# EAGLE design myRelay (EAGLE 7.6.0)
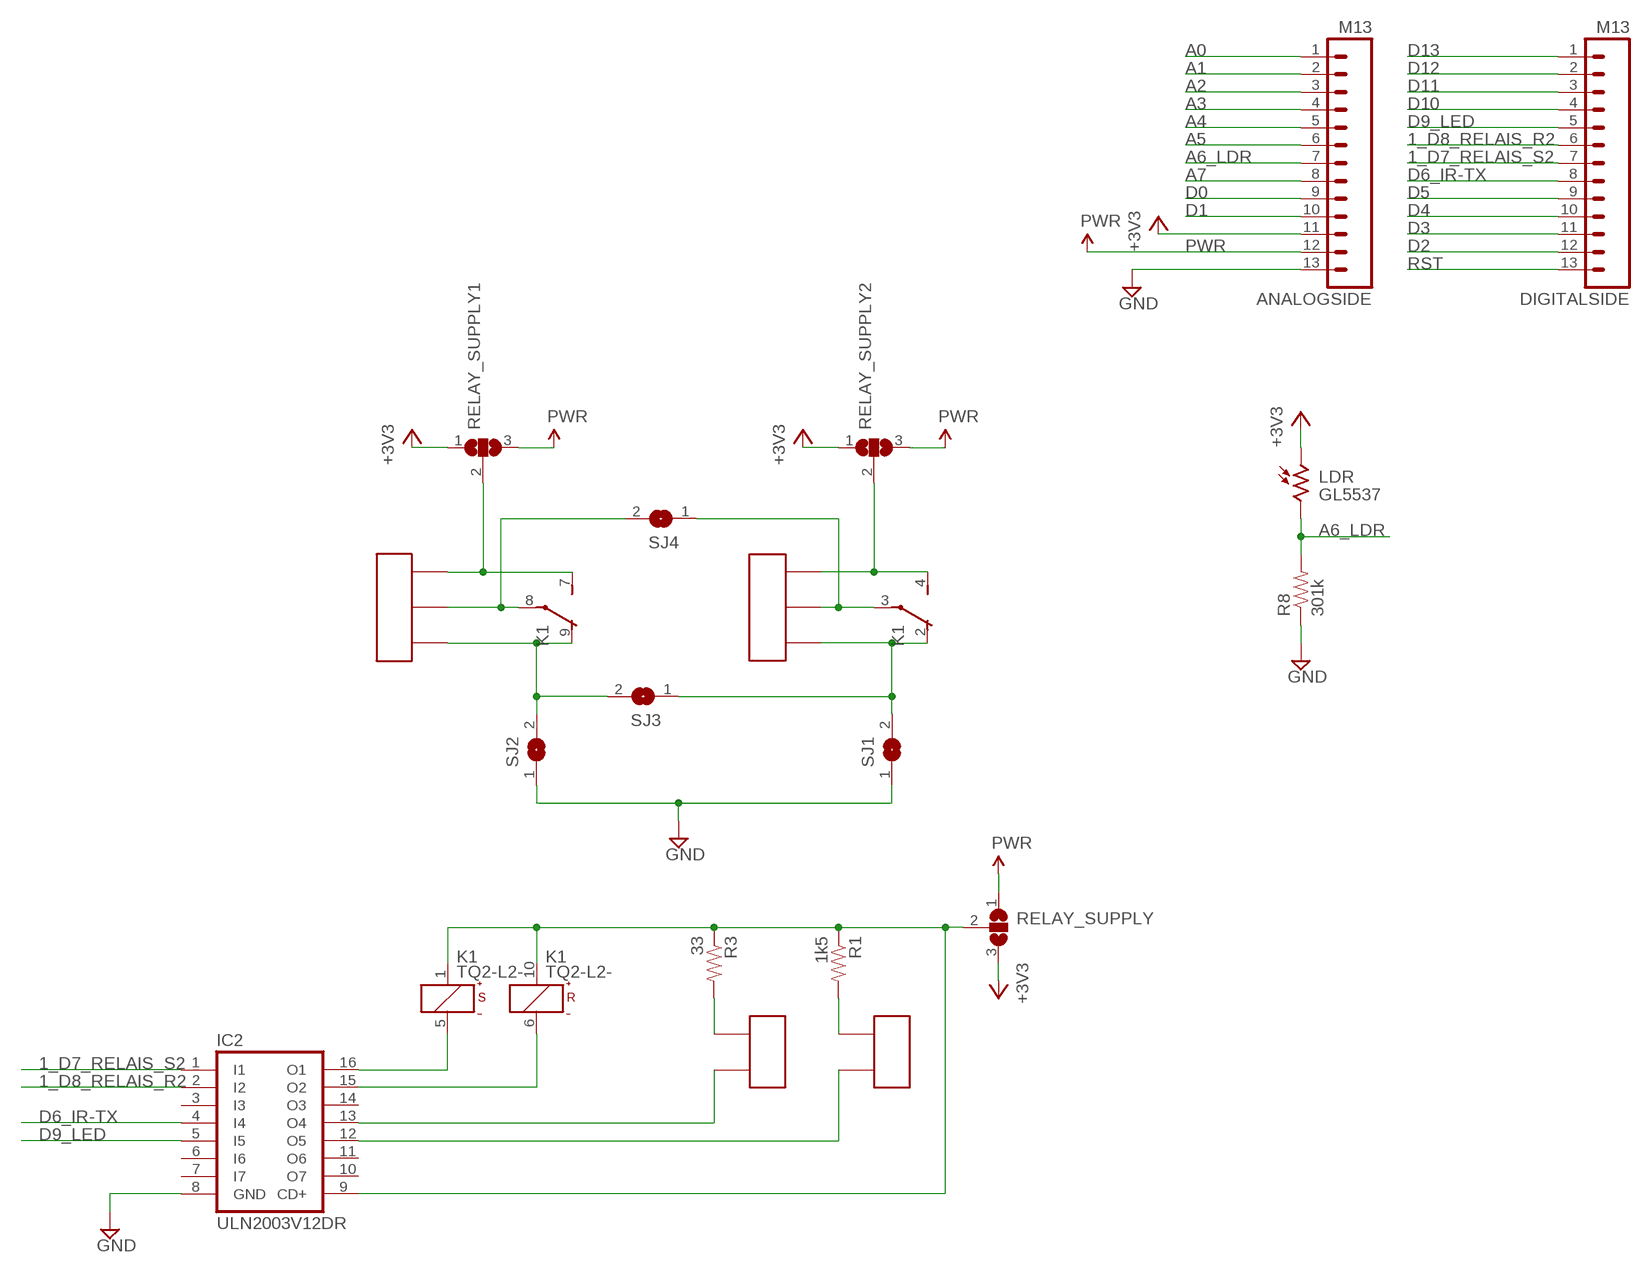
[diagram p0: schematic, sheet 1]

## Parts
ANALOGSIDE  M13  [1X13]
DIGITALSIDE  M13  [1X13]
IC2  ULN2003V12DR  ULN2003AD  [SO16]
K1  TQ2-L2-  [TQ2]
LDR  GL5537  M9960_11A  [M9960]
R1  1k5  RESISTOR0603-RES  [0603-RES]
R3  33  RESISTOR0603-RES  [0603-RES]
R8  301k  RESISTOR0603-RES  [0603-RES]
RELAY_SUPPLY  SJ2WW  [SJ_2W]
RELAY_SUPPLY1  SJ2WW  [SJ_2W]
RELAY_SUPPLY2  SJ2WW  [SJ_2W]
SJ1  SJW  [SJW]
SJ2  SJW  [SJW]
SJ3  SJW  [SJW]
SJ4  SJW  [SJW]
U$1  HDR_3PINLUMBERG_KRMC  [1X03_LUMBERG-KRMC_3,5MM]
U$2  HDR_3PINLUMBERG_KRMC  [1X03_LUMBERG-KRMC_3,5MM]
U$3  HDR_2PIN  [1X02_NS]
U$4  HDR_2PIN  [1X02_NS]

## Nets
1_D7_RELAIS_S2: DIGITALSIDE.7 IC2.1(I1)
1_D8_RELAIS_R2: DIGITALSIDE.6 IC2.2(I2)
+3V3 [power]: ANALOGSIDE.11 LDR.1 RELAY_SUPPLY1.1 RELAY_SUPPLY2.1 RELAY_SUPPLY.3
A0: ANALOGSIDE.1
A1: ANALOGSIDE.2
A2: ANALOGSIDE.3
A3: ANALOGSIDE.4
A4: ANALOGSIDE.5
A5: ANALOGSIDE.6
A6_LDR: ANALOGSIDE.7 LDR.2 R8.2
A7: ANALOGSIDE.8
D0: ANALOGSIDE.9
D1: ANALOGSIDE.10
D2: DIGITALSIDE.12
D3: DIGITALSIDE.11
D4: DIGITALSIDE.10
D5: DIGITALSIDE.9
D6_IR-TX: DIGITALSIDE.8 IC2.4(I4)
D9_LED: DIGITALSIDE.5 IC2.5(I5)
D10: DIGITALSIDE.4
D11: DIGITALSIDE.3
D12: DIGITALSIDE.2
D13: DIGITALSIDE.1
GND [high_power]: ANALOGSIDE.13 IC2.8(GND) R8.1 SJ1.1 SJ2.1
N$1 [high_power]: K1.8(2:P) SJ4.2 U$1.2
N$2 [high_power]: K1.9(2:O) SJ2.2 SJ3.2 U$1.1
N$3 [high_power]: K1.7(2:S) RELAY_SUPPLY1.2 U$1.3
N$4 [power]: R3.2 U$3.1
N$5: IC2.16(O1) K1.5(S:-)
N$6: IC2.15(O2) K1.6(R:-)
N$7 [power]: IC2.13(O4) U$3.2
N$8 [high_power]: K1.4(1:S) RELAY_SUPPLY2.2 U$2.1
N$9 [high_power]: K1.2(1:O) SJ1.2 SJ3.1 U$2.3
N$10 [power]: R1.2 U$4.1
N$11 [high_power]: K1.3(1:P) SJ4.1 U$2.2
N$12 [power]: IC2.12(O5) U$4.2
N$23 [power]: IC2.9(CD+) K1.1(S:+) K1.10(R:+) R1.1 R3.1 RELAY_SUPPLY.2
PWR [power]: ANALOGSIDE.12 RELAY_SUPPLY1.3 RELAY_SUPPLY2.3 RELAY_SUPPLY.1
RST: DIGITALSIDE.13
Unconnected: IC2.3(I3) IC2.6(I6) IC2.7(I7) IC2.10(O7) IC2.11(O6) IC2.14(O3)

## Library data of the parts
ANALOGSIDE DIGITALSIDE = SparkFun-Connectors:M13: 13-pin single row .1" header; BUERKLIN: 59 F 2140
IC2 = uln-udn:ULN2003A: DRIVER ARRAY; CONRAD: 1187534 - 62
K1 = relay:TQ2?-L2-*: LOW PROFILE 2 FORM C RELAY NAiS 2 coil latching Source: http://www.mew-europe.com/.. en_ds_61020_0001.pdf Source: http://www.mew-europe.com/.. en_ds_61020_0002.pdf; BUERKLIN: 30 G 7570; MF: AROMAT/ MATSUSHITA; MPN: TQ2-L2-3V; OC_FARNELL: 1217662; OC_NEWARK: 64K3196
LDR = photo-elements:M9960_11: Photo Sensor Beacon Light, Photometer Applications Source: http://optoelectronics.perkinelmer.com/content/Datasheets/DTS_M9960.pdf; EBAY: GL5537
R1 = LowPowerLab:RESISTOR: Resistor Basic schematic elements and footprints for 0603, 1206, and PTH resistors.; BUERKLIN: 26 E 796
R3 = LowPowerLab:RESISTOR: Resistor Basic schematic elements and footprints for 0603, 1206, and PTH resistors.; BUERKLIN: 26 E 756
R8 = LowPowerLab:RESISTOR: Resistor Basic schematic elements and footprints for 0603, 1206, and PTH resistors.; BUERKLIN: 26 E 7197
RELAY_SUPPLY RELAY_SUPPLY1 RELAY_SUPPLY2 = jumper:SJ2W: SMD solder JUMPER
SJ1-SJ4 = jumper:SJ: SMD solder JUMPER
U$1 U$2 = myLib:HDR_3PIN; BUERKLIN: 08 H 602
U$3 U$4 = myLib:HDR_2PIN

## Net classes
0 default: width 0.381 mm, clearance 0.254 mm
1 power: width 0.508 mm, clearance 0.254 mm
3 high_power: width 0.762 mm, clearance 0.381 mm

## Board
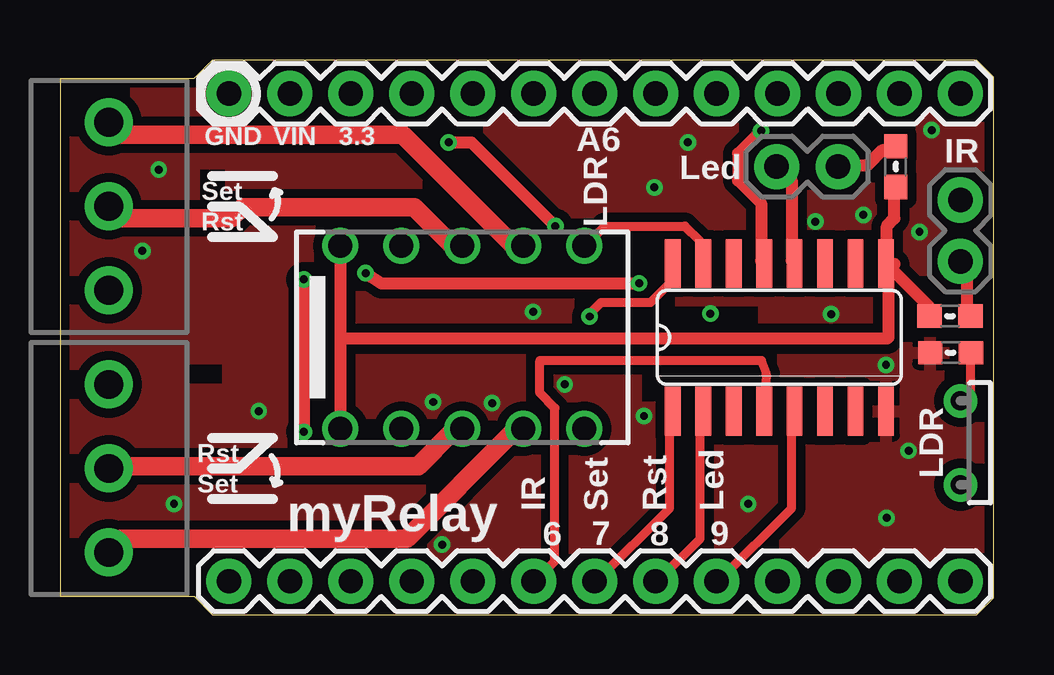
[diagram p1: board, top side]
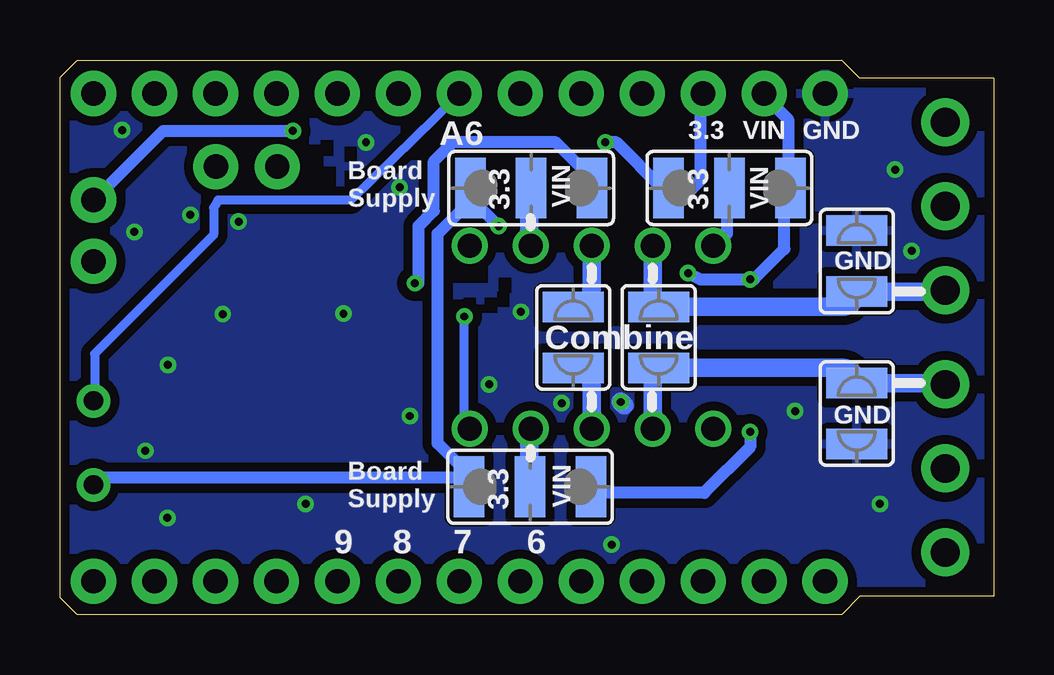
[diagram p2: board, bottom side, seen from below]

Size 38.91 x 23.11 mm. Coordinates in mm from the lower left corner, seen from the top.
Outline: 6.35,0 38.2,0 38.91,0.71 38.91,22.4 38.2,23.11 6.35,23.11 5.59,22.35 0,22.35 0,0.76 5.59,0.76 6.35,0
Copper layers (1*16): Top 0.0356mm / dielectric 1.5011mm / Bottom 0.0356mm
Design rules "oshpark-2layer": minimum track width 6mil, minimum drill 13mil, track to track 6mil, track to pad 6mil, pad to pad 6mil, via to via 6mil, smd to smd 6mil, copper to edge 15mil, drill to drill 6mil, minimum pad ring 7mil, minimum via ring 7mil, stop-mask expansion 2.5mil, vias tented up to drill 0mil, thermal gap 10mil
tRestrict: area 24.3,8.9 to 29.1,12.8; area 5.8,16.9 to 6.9,18.5; area 5.2,9.7 to 6.7,10.4
bRestrict: area 27.4,17.7 to 29.2,18.7; area 21.1,13.8 to 22.9,14.9; area 21.6,12.6 to 22.1,13.2; area 20.7,12.6 to 21.2,13.2; area 20.2,12.8 to 20.7,13.5; area 20.1,13.4 to 20.6,14; area 26.5,18.9 to 27.1,19.5; area 26.5,17.9 to 27.1,18.5; area 27.5,19.1 to 28,19.8; area 27.9,18.8 to 29.1,19.6

### Footprints (pad centres in the part's own frame; a part is rotated, then mirrored left to right if it is on the bottom)
1X13 = drill 1.016 pad 1.88: 1 0,0; 2 2.54,0; 3 5.08,0; 4 7.62,0; 5 10.16,0; 6 12.7,0; 7 15.24,0; 8 17.78,0; 9 20.32,0; 10 22.86,0; 11 25.4,0; 12 27.94,0; 13 30.48,0
SO16 = smd 0.66 x 2.032: 1 -4.445,-3.073; 2 -3.175,-3.073; 3 -1.905,-3.073; 4 -0.635,-3.073; 5 0.635,-3.073; 6 1.905,-3.073; 7 3.175,-3.073; 8 4.445,-3.073; 9 4.445,3.073; 10 3.175,3.073; 11 1.905,3.073; 12 0.635,3.073; 13 -0.635,3.073; 14 -1.905,3.073; 15 -3.175,3.073; 16 -4.445,3.073
TQ2 = drill 1: 1 -5.08,-3.81; 2 -2.54,-3.81; 3 0,-3.81; 4 2.54,-3.81; 5 5.08,-3.81; 6 5.08,3.81; 7 2.54,3.81; 8 0,3.81; 9 -2.54,3.81; 10 -5.08,3.81
M9960 = drill 0.8 pad 1.4: 1 -1.75,0; 2 1.75,0
0603-RES = smd 1.016 x 0.965: 1 -0.85,0; 2 0.85,0
SJ_2W = smd 1.27 x 2.54: 1 -2.54,0; 2 0,0; 3 2.54,0
SJW = smd 1.27 x 2.54: 1 -1.27,0; 2 1.27,0
1X03_LUMBERG-KRMC_3,5MM = drill 1.2 pad 2: 1 -3.5,0; 2 0,0; 3 3.5,0
1X02_NS = drill 1.016 pad 1.88: 1 -1.28,0; 2 1.28,0

### Placement (x,y rotation side)
ANALOGSIDE  37.52,21.72 180 top
DIGITALSIDE  37.52,1.4 180 top
IC2  29.97,11.56 0 top
K1  16.76,11.56 0 top
LDR  37.52,7.16 90 top
R1  34.82,18.67 90 top
R3  37.08,12.45 0 top
R8  37.11,10.92 0 top
RELAY_SUPPLY  11.02,17.78 180 bottom
RELAY_SUPPLY1  19.28,17.78 0 bottom
RELAY_SUPPLY2  19.32,5.33 0 bottom
SJ1  5.71,8.38 90 bottom
SJ2  5.71,14.73 270 bottom
SJ3  13.97,11.56 90 bottom
SJ4  17.53,11.56 90 bottom
U$1  2.03,17.02 90 top
U$2  2.03,6.1 90 top
U$3  37.52,16 90 top
U$4  31.14,18.67 180 top

### Tracks (layer width: path | path; a pad name or v marks a point on that pad's centre or on a via)
1_D7_RELAIS_S2
  Top 0.381: IC2.1 25.4,8.41 25.4,4.45 22.38,1.43 DIGITALSIDE.7
1_D8_RELAIS_R2
  Top 0.381: IC2.2 26.67,8.41 26.67,3.17 24.92,1.43 DIGITALSIDE.6
+3V3  (via drill 0.33)
  Top 0.508: v20.64,16.19 17.14,19.68 v16.19,19.68
  Bottom 0.508: 21.75,5.71 21.75,5.4 RELAY_SUPPLY2.1 | v20.64,16.19 21.75,17.3 21.75,17.78 RELAY_SUPPLY1.1 21.91,17.14 23.18,15.88 23.18,7.14 21.91,5.87 RELAY_SUPPLY2.1 | ANALOGSIDE.11 12.22,21.59 12.22,18.1 12.54,17.78 RELAY_SUPPLY.3 13.81,17.78 15.72,19.68 v16.19,19.68 | LDR.1 37.47,5.71 22.23,5.71 RELAY_SUPPLY2.1
A6_LDR
  Top 0.381: R8.2 37.94,10.95 37.94,9.37 37.62,9.05 LDR.2
  Bottom 0.381: LDR.2 37.47,9.05 37.47,10.87 32.51,15.82 32.51,16.95 32.32,17.27 26.8,17.27 22.38,21.59 ANALOGSIDE.7
D6_IR-TX
  Top 0.381: 29.37,8.57 IC2.4 29.37,8.73 29.42,10.04 29.22,10.59 19.99,10.59 19.99,9.25 20.62,8.61 20.62,2.23 20.61,2.22 19.84,1.43 DIGITALSIDE.8
D9_LED
  Top 0.381: IC2.5 30.48,8.41 30.48,4.45 27.46,1.43 DIGITALSIDE.5
GND  (via drill 0.33)
  Bottom 0.762: 15.4,8.73 v15.54,8.87
  other vias: 8.28,8.48 4.75,4.62 4.11,18.54 34.44,4.04 28.68,4.62 18.01,8.81 19.71,12.62 34.42,10.41 35.36,6.83 27.1,12.55 24.77,17.81 24.33,8.28 15.93,2.92 32.13,12.52 26.16,19.68 33.48,16.66 31.47,16.38 35.81,15.95 36.32,20.19 3.43,15.16 21.03,9.6
  pour Bottom: -0.64,24 -1.3,-1.55 41.63,-1.57 42.11,24.23
  pour Top: -0.64,24 -0.94,-0.61 40.92,-0.66 41.22,23.95
N$1
  Top 0.762: U$1.2 2.54,16.51 7.14,16.51 7.62,16.99 14.76,16.99 16.35,15.4 16.67,15.4 K1.8
  Bottom 0.762: SJ4.2 arc-90 16.76,13.59 K1.8
N$2
  Bottom 0.762: U$1.1 arc90 2.09,13.46 SJ2.2 arc90 6.35,12.83 SJ3.2 arc90 14.22,13.08 K1.9
N$3
  Top 0.762: K1.7 19.21,15.4 18.89,15.4 14.29,20 2.54,20 2.06,20.48 U$1.3
  Bottom 0.762: RELAY_SUPPLY1.2 19.37,17.78 19.37,15.4 K1.7
N$4
  Top 0.508: R3.2 37.78,12.54 37.78,14.45 37.62,14.61 U$3.1
N$5  (via drill 0.33)
  Top 0.381: 25.4,13.97 25.4,14.61 IC2.16 25.4,13.81 24.61,13.02 22.54,13.02 22.07,12.54 v22.07,12.43
  Bottom 0.381: v22.07,12.43 22.07,7.94 21.91,7.78 K1.5
N$6
  Top 0.381: IC2.15 26.67,14.76 26.67,15.56 26.04,16.19 22.7,16.19 21.91,15.4 K1.6
N$7  (via drill 0.33)
  Top 0.508: v29.21,20.16 28.26,19.21 28.26,18.1 29.21,17.14 29.21,14.76 IC2.13
  Bottom 0.508: v29.21,20.16 34.61,20.16 37.47,17.3 U$3.2
N$8
  Top 0.762: K1.4 19.21,7.62 18.89,7.62 14.45,3.17 2.54,3.17 2.06,2.7 U$2.1
  Bottom 0.762: RELAY_SUPPLY2.2 19.37,5.4 19.37,7.62 K1.4
N$9
  Bottom 0.762: U$2.3 arc-90 2.09,9.65 SJ1.2 arc-90 6.35,10.29 SJ3.1 arc-90 14.22,10.03 K1.2
  Bottom 0.813: 5.71,9.6 SJ1.2
N$10
  Top 0.508: R1.2 34.77,19.37 34.29,19.37 33.66,18.73 32.54,18.73 U$4.1
N$11
  Top 0.762: K1.3 16.67,7.62 16.35,7.62 14.92,6.19 2.06,6.19 U$2.2
  Bottom 0.762: SJ4.1 arc90 16.76,9.53 K1.3
N$12
  Top 0.508: IC2.12 30.48,14.76 30.48,18.1 30,18.57 U$4.2
N$23
  Top 0.508: 34.61,14.45 34.45,14.61 IC2.9 | 34.61,14.45 36.2,12.86 36.2,12.38 R3.1 36.04,12.22 | 34.77,17.78 R1.1 34.77,17.62 34.77,16.51 34.45,16.19 34.45,14.76 IC2.9 | 34.77,14.61 34.61,14.45 | K1.10 11.68,11.51 | 11.68,11.51 K1.1 | IC2.9 34.52,14.53 34.52,11.56 34.47,11.51 11.68,11.51
  Bottom 0.508: RELAY_SUPPLY.2 11.11,17.62 11.11,15.88 11.59,15.4 K1.10 | 11.59,7.78 K1.1
PWR  (via drill 0.33)
  Top 0.508: v12.74,14.23 13.39,13.81 v24.13,13.81 | v10.16,13.97 v10.16,7.62
  Bottom 0.508: 16.83,4.92 16.83,5.24 RELAY_SUPPLY2.3 16.51,5.08 12.06,5.08 10.16,6.99 v10.16,7.62 | RELAY_SUPPLY1.3 16.51,17.94 18.26,19.68 22.54,19.68 23.34,18.89 23.34,16.83 23.97,16.19 23.97,13.81 v24.13,13.81 | ANALOGSIDE.12 9.53,21.59 8.57,20.64 8.57,17.78 RELAY_SUPPLY.1 8.73,17.62 8.73,15.24 10,13.97 v10.16,13.97 12.22,13.97 v12.74,14.23

### Text on the board
tPlace: myRelay
_tsilk: GND | VIN | 3.3 | A6 | IR | LDR | Led | Set | Rst | LDR | Rst | Set | IR | 6 | Set | 7 | Rst | 8 | Led | 9
_bsilk: GND | VIN | 3.3 | A6 | Board / Supply | VIN | 3.3 | VIN | 3.3 | GND | Combine | GND | Board / Supply | VIN | 6 | 3.3 | 7 | 8 | 9